# EAGLE schematic ArrayC_v0zp (EAGLE 7.5.0)
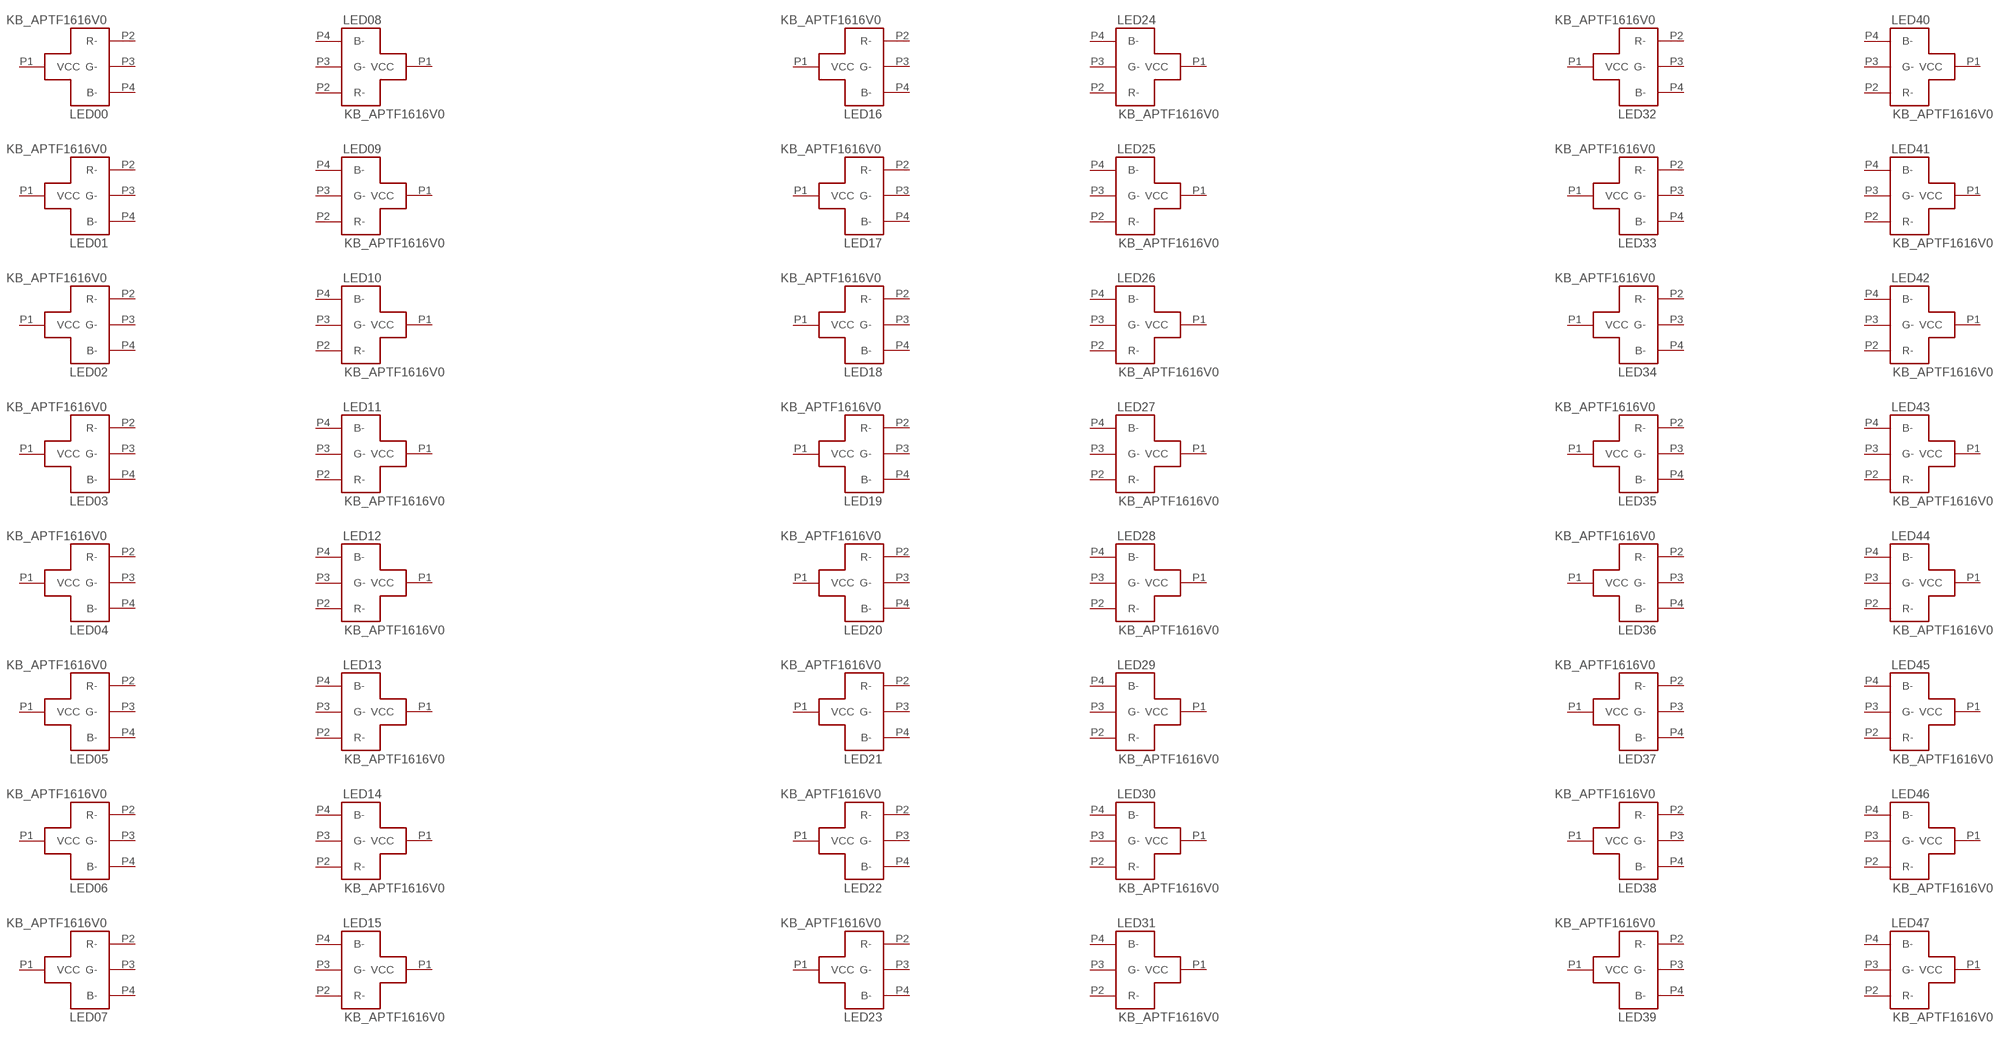
[diagram p0: schematic, sheet 1, part 1 of 2]
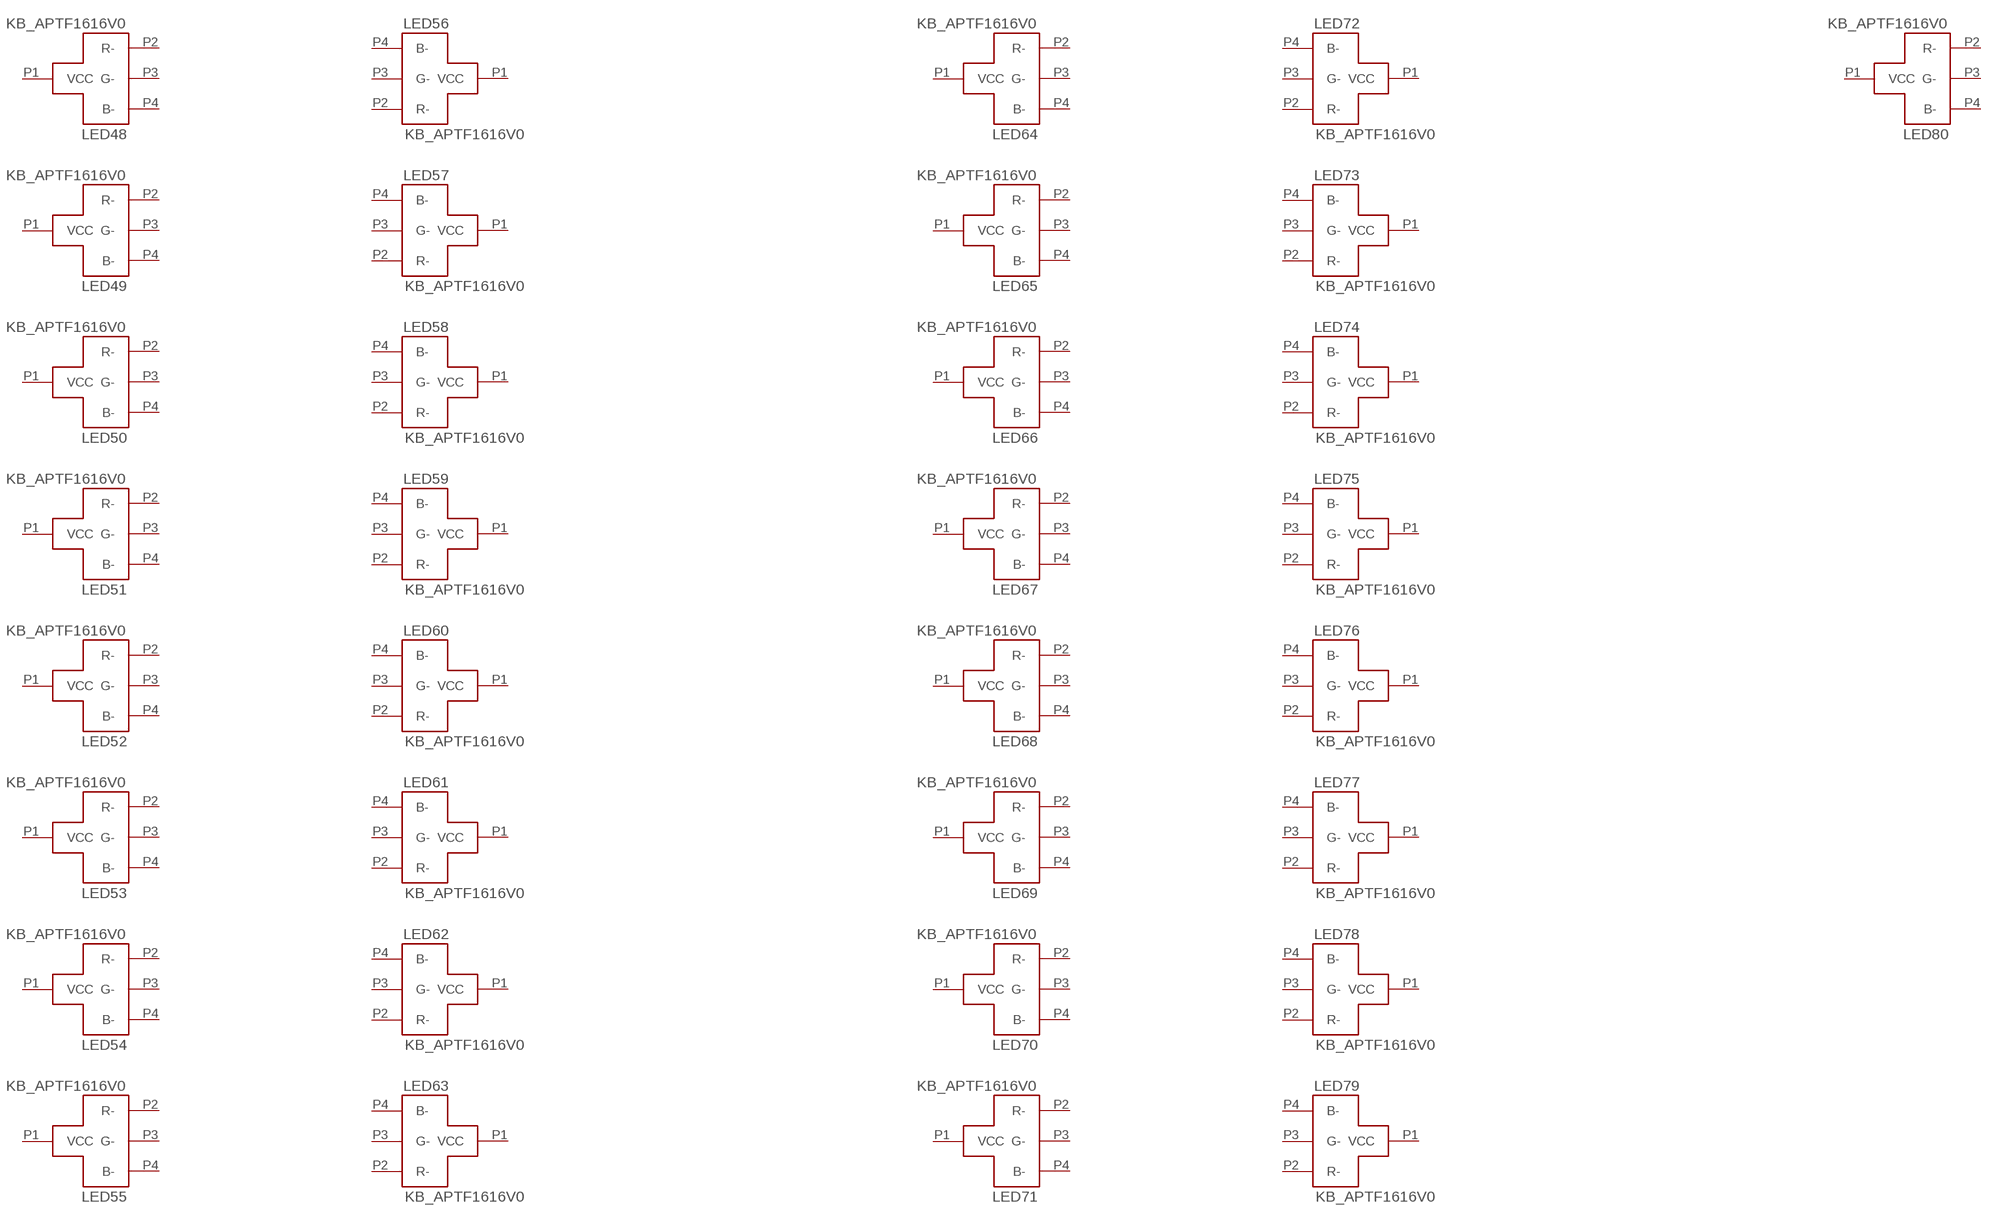
[diagram p1: schematic, sheet 1, part 2 of 2]

## Parts
LED00  KB_APTF1616V0  [KB_RGBLED_APTF1616]
LED01  KB_APTF1616V0  [KB_RGBLED_APTF1616]
LED02  KB_APTF1616V0  [KB_RGBLED_APTF1616]
LED03  KB_APTF1616V0  [KB_RGBLED_APTF1616]
LED04  KB_APTF1616V0  [KB_RGBLED_APTF1616]
LED05  KB_APTF1616V0  [KB_RGBLED_APTF1616]
LED06  KB_APTF1616V0  [KB_RGBLED_APTF1616]
LED07  KB_APTF1616V0  [KB_RGBLED_APTF1616]
LED08  KB_APTF1616V0  [KB_RGBLED_APTF1616]
LED09  KB_APTF1616V0  [KB_RGBLED_APTF1616]
LED10  KB_APTF1616V0  [KB_RGBLED_APTF1616]
LED11  KB_APTF1616V0  [KB_RGBLED_APTF1616]
LED12  KB_APTF1616V0  [KB_RGBLED_APTF1616]
LED13  KB_APTF1616V0  [KB_RGBLED_APTF1616]
LED14  KB_APTF1616V0  [KB_RGBLED_APTF1616]
LED15  KB_APTF1616V0  [KB_RGBLED_APTF1616]
LED16  KB_APTF1616V0  [KB_RGBLED_APTF1616]
LED17  KB_APTF1616V0  [KB_RGBLED_APTF1616]
LED18  KB_APTF1616V0  [KB_RGBLED_APTF1616]
LED19  KB_APTF1616V0  [KB_RGBLED_APTF1616]
LED20  KB_APTF1616V0  [KB_RGBLED_APTF1616]
LED21  KB_APTF1616V0  [KB_RGBLED_APTF1616]
LED22  KB_APTF1616V0  [KB_RGBLED_APTF1616]
LED23  KB_APTF1616V0  [KB_RGBLED_APTF1616]
LED24  KB_APTF1616V0  [KB_RGBLED_APTF1616]
LED25  KB_APTF1616V0  [KB_RGBLED_APTF1616]
LED26  KB_APTF1616V0  [KB_RGBLED_APTF1616]
LED27  KB_APTF1616V0  [KB_RGBLED_APTF1616]
LED28  KB_APTF1616V0  [KB_RGBLED_APTF1616]
LED29  KB_APTF1616V0  [KB_RGBLED_APTF1616]
LED30  KB_APTF1616V0  [KB_RGBLED_APTF1616]
LED31  KB_APTF1616V0  [KB_RGBLED_APTF1616]
LED32  KB_APTF1616V0  [KB_RGBLED_APTF1616]
LED33  KB_APTF1616V0  [KB_RGBLED_APTF1616]
LED34  KB_APTF1616V0  [KB_RGBLED_APTF1616]
LED35  KB_APTF1616V0  [KB_RGBLED_APTF1616]
LED36  KB_APTF1616V0  [KB_RGBLED_APTF1616]
LED37  KB_APTF1616V0  [KB_RGBLED_APTF1616]
LED38  KB_APTF1616V0  [KB_RGBLED_APTF1616]
LED39  KB_APTF1616V0  [KB_RGBLED_APTF1616]
LED40  KB_APTF1616V0  [KB_RGBLED_APTF1616]
LED41  KB_APTF1616V0  [KB_RGBLED_APTF1616]
LED42  KB_APTF1616V0  [KB_RGBLED_APTF1616]
LED43  KB_APTF1616V0  [KB_RGBLED_APTF1616]
LED44  KB_APTF1616V0  [KB_RGBLED_APTF1616]
LED45  KB_APTF1616V0  [KB_RGBLED_APTF1616]
LED46  KB_APTF1616V0  [KB_RGBLED_APTF1616]
LED47  KB_APTF1616V0  [KB_RGBLED_APTF1616]
LED48  KB_APTF1616V0  [KB_RGBLED_APTF1616]
LED49  KB_APTF1616V0  [KB_RGBLED_APTF1616]
LED50  KB_APTF1616V0  [KB_RGBLED_APTF1616]
LED51  KB_APTF1616V0  [KB_RGBLED_APTF1616]
LED52  KB_APTF1616V0  [KB_RGBLED_APTF1616]
LED53  KB_APTF1616V0  [KB_RGBLED_APTF1616]
LED54  KB_APTF1616V0  [KB_RGBLED_APTF1616]
LED55  KB_APTF1616V0  [KB_RGBLED_APTF1616]
LED56  KB_APTF1616V0  [KB_RGBLED_APTF1616]
LED57  KB_APTF1616V0  [KB_RGBLED_APTF1616]
LED58  KB_APTF1616V0  [KB_RGBLED_APTF1616]
LED59  KB_APTF1616V0  [KB_RGBLED_APTF1616]
LED60  KB_APTF1616V0  [KB_RGBLED_APTF1616]
LED61  KB_APTF1616V0  [KB_RGBLED_APTF1616]
LED62  KB_APTF1616V0  [KB_RGBLED_APTF1616]
LED63  KB_APTF1616V0  [KB_RGBLED_APTF1616]
LED64  KB_APTF1616V0  [KB_RGBLED_APTF1616]
LED65  KB_APTF1616V0  [KB_RGBLED_APTF1616]
LED66  KB_APTF1616V0  [KB_RGBLED_APTF1616]
LED67  KB_APTF1616V0  [KB_RGBLED_APTF1616]
LED68  KB_APTF1616V0  [KB_RGBLED_APTF1616]
LED69  KB_APTF1616V0  [KB_RGBLED_APTF1616]
LED70  KB_APTF1616V0  [KB_RGBLED_APTF1616]
LED71  KB_APTF1616V0  [KB_RGBLED_APTF1616]
LED72  KB_APTF1616V0  [KB_RGBLED_APTF1616]
LED73  KB_APTF1616V0  [KB_RGBLED_APTF1616]
LED74  KB_APTF1616V0  [KB_RGBLED_APTF1616]
LED75  KB_APTF1616V0  [KB_RGBLED_APTF1616]
LED76  KB_APTF1616V0  [KB_RGBLED_APTF1616]
LED77  KB_APTF1616V0  [KB_RGBLED_APTF1616]
LED78  KB_APTF1616V0  [KB_RGBLED_APTF1616]
LED79  KB_APTF1616V0  [KB_RGBLED_APTF1616]
LED80  KB_APTF1616V0  [KB_RGBLED_APTF1616]
Unconnected: LED00.P1(VCC) LED00.P2(R-) LED00.P3(G-) LED00.P4(B-) LED01.P1(VCC) LED01.P2(R-) LED01.P3(G-) LED01.P4(B-) LED02.P1(VCC) LED02.P2(R-) LED02.P3(G-) LED02.P4(B-) LED03.P1(VCC) LED03.P2(R-) LED03.P3(G-) LED03.P4(B-) LED04.P1(VCC) LED04.P2(R-) LED04.P3(G-) LED04.P4(B-) LED05.P1(VCC) LED05.P2(R-) LED05.P3(G-) LED05.P4(B-) LED06.P1(VCC) LED06.P2(R-) LED06.P3(G-) LED06.P4(B-) LED07.P1(VCC) LED07.P2(R-) LED07.P3(G-) LED07.P4(B-) LED08.P1(VCC) LED08.P2(R-) LED08.P3(G-) LED08.P4(B-) LED09.P1(VCC) LED09.P2(R-) LED09.P3(G-) LED09.P4(B-) LED10.P1(VCC) LED10.P2(R-) LED10.P3(G-) LED10.P4(B-) LED11.P1(VCC) LED11.P2(R-) LED11.P3(G-) LED11.P4(B-) LED12.P1(VCC) LED12.P2(R-) LED12.P3(G-) LED12.P4(B-) LED13.P1(VCC) LED13.P2(R-) LED13.P3(G-) LED13.P4(B-) LED14.P1(VCC) LED14.P2(R-) LED14.P3(G-) LED14.P4(B-) LED15.P1(VCC) LED15.P2(R-) LED15.P3(G-) LED15.P4(B-) LED16.P1(VCC) LED16.P2(R-) LED16.P3(G-) LED16.P4(B-) LED17.P1(VCC) LED17.P2(R-) LED17.P3(G-) LED17.P4(B-) LED18.P1(VCC) LED18.P2(R-) LED18.P3(G-) LED18.P4(B-) LED19.P1(VCC) LED19.P2(R-) LED19.P3(G-) LED19.P4(B-) LED20.P1(VCC) LED20.P2(R-) LED20.P3(G-) LED20.P4(B-) LED21.P1(VCC) LED21.P2(R-) LED21.P3(G-) LED21.P4(B-) LED22.P1(VCC) LED22.P2(R-) LED22.P3(G-) LED22.P4(B-) LED23.P1(VCC) LED23.P2(R-) LED23.P3(G-) LED23.P4(B-) LED24.P1(VCC) LED24.P2(R-) LED24.P3(G-) LED24.P4(B-) LED25.P1(VCC) LED25.P2(R-) LED25.P3(G-) LED25.P4(B-) LED26.P1(VCC) LED26.P2(R-) LED26.P3(G-) LED26.P4(B-) LED27.P1(VCC) LED27.P2(R-) LED27.P3(G-) LED27.P4(B-) LED28.P1(VCC) LED28.P2(R-) LED28.P3(G-) LED28.P4(B-) LED29.P1(VCC) LED29.P2(R-) LED29.P3(G-) LED29.P4(B-) LED30.P1(VCC) LED30.P2(R-) LED30.P3(G-) LED30.P4(B-) LED31.P1(VCC) LED31.P2(R-) LED31.P3(G-) LED31.P4(B-) LED32.P1(VCC) LED32.P2(R-) LED32.P3(G-) LED32.P4(B-) LED33.P1(VCC) LED33.P2(R-) LED33.P3(G-) LED33.P4(B-) LED34.P1(VCC) LED34.P2(R-) LED34.P3(G-) LED34.P4(B-) LED35.P1(VCC) LED35.P2(R-) LED35.P3(G-) LED35.P4(B-) LED36.P1(VCC) LED36.P2(R-) LED36.P3(G-) LED36.P4(B-) LED37.P1(VCC) LED37.P2(R-) LED37.P3(G-) LED37.P4(B-) LED38.P1(VCC) LED38.P2(R-) LED38.P3(G-) LED38.P4(B-) LED39.P1(VCC) LED39.P2(R-) LED39.P3(G-) LED39.P4(B-) LED40.P1(VCC) LED40.P2(R-) LED40.P3(G-) LED40.P4(B-) LED41.P1(VCC) LED41.P2(R-) LED41.P3(G-) LED41.P4(B-) LED42.P1(VCC) LED42.P2(R-) LED42.P3(G-) LED42.P4(B-) LED43.P1(VCC) LED43.P2(R-) LED43.P3(G-) LED43.P4(B-) LED44.P1(VCC) LED44.P2(R-) LED44.P3(G-) LED44.P4(B-) LED45.P1(VCC) LED45.P2(R-) LED45.P3(G-) LED45.P4(B-) LED46.P1(VCC) LED46.P2(R-) LED46.P3(G-) LED46.P4(B-) LED47.P1(VCC) LED47.P2(R-) LED47.P3(G-) LED47.P4(B-) LED48.P1(VCC) LED48.P2(R-) LED48.P3(G-) LED48.P4(B-) LED49.P1(VCC) LED49.P2(R-) LED49.P3(G-) LED49.P4(B-) LED50.P1(VCC) LED50.P2(R-) LED50.P3(G-) LED50.P4(B-) LED51.P1(VCC) LED51.P2(R-) LED51.P3(G-) LED51.P4(B-) LED52.P1(VCC) LED52.P2(R-) LED52.P3(G-) LED52.P4(B-) LED53.P1(VCC) LED53.P2(R-) LED53.P3(G-) LED53.P4(B-) LED54.P1(VCC) LED54.P2(R-) LED54.P3(G-) LED54.P4(B-) LED55.P1(VCC) LED55.P2(R-) LED55.P3(G-) LED55.P4(B-) LED56.P1(VCC) LED56.P2(R-) LED56.P3(G-) LED56.P4(B-) LED57.P1(VCC) LED57.P2(R-) LED57.P3(G-) LED57.P4(B-) LED58.P1(VCC) LED58.P2(R-) LED58.P3(G-) LED58.P4(B-) LED59.P1(VCC) LED59.P2(R-) LED59.P3(G-) LED59.P4(B-) LED60.P1(VCC) LED60.P2(R-) LED60.P3(G-) LED60.P4(B-) LED61.P1(VCC) LED61.P2(R-) LED61.P3(G-) LED61.P4(B-) LED62.P1(VCC) LED62.P2(R-) LED62.P3(G-) LED62.P4(B-) LED63.P1(VCC) LED63.P2(R-) LED63.P3(G-) LED63.P4(B-) LED64.P1(VCC) LED64.P2(R-) LED64.P3(G-) LED64.P4(B-) LED65.P1(VCC) LED65.P2(R-) LED65.P3(G-) LED65.P4(B-) LED66.P1(VCC) LED66.P2(R-) LED66.P3(G-) LED66.P4(B-) LED67.P1(VCC) LED67.P2(R-) LED67.P3(G-) LED67.P4(B-) LED68.P1(VCC) LED68.P2(R-) LED68.P3(G-) LED68.P4(B-) LED69.P1(VCC) LED69.P2(R-) LED69.P3(G-) LED69.P4(B-) LED70.P1(VCC) LED70.P2(R-) LED70.P3(G-) LED70.P4(B-) LED71.P1(VCC) LED71.P2(R-) LED71.P3(G-) LED71.P4(B-) LED72.P1(VCC) LED72.P2(R-) LED72.P3(G-) LED72.P4(B-) LED73.P1(VCC) LED73.P2(R-) LED73.P3(G-) LED73.P4(B-) LED74.P1(VCC) LED74.P2(R-) LED74.P3(G-) LED74.P4(B-) LED75.P1(VCC) LED75.P2(R-) LED75.P3(G-) LED75.P4(B-) LED76.P1(VCC) LED76.P2(R-) LED76.P3(G-) LED76.P4(B-) LED77.P1(VCC) LED77.P2(R-) LED77.P3(G-) LED77.P4(B-) LED78.P1(VCC) LED78.P2(R-) LED78.P3(G-) LED78.P4(B-) LED79.P1(VCC) LED79.P2(R-) LED79.P3(G-) LED79.P4(B-) LED80.P1(VCC) LED80.P2(R-) LED80.P3(G-) LED80.P4(B-)

## Library data of the parts
LED00 LED01-LED09 LED10-LED80 = WallerLabLib:KB_APTF1616